# EAGLE design schematic (EAGLE 9.6.2)
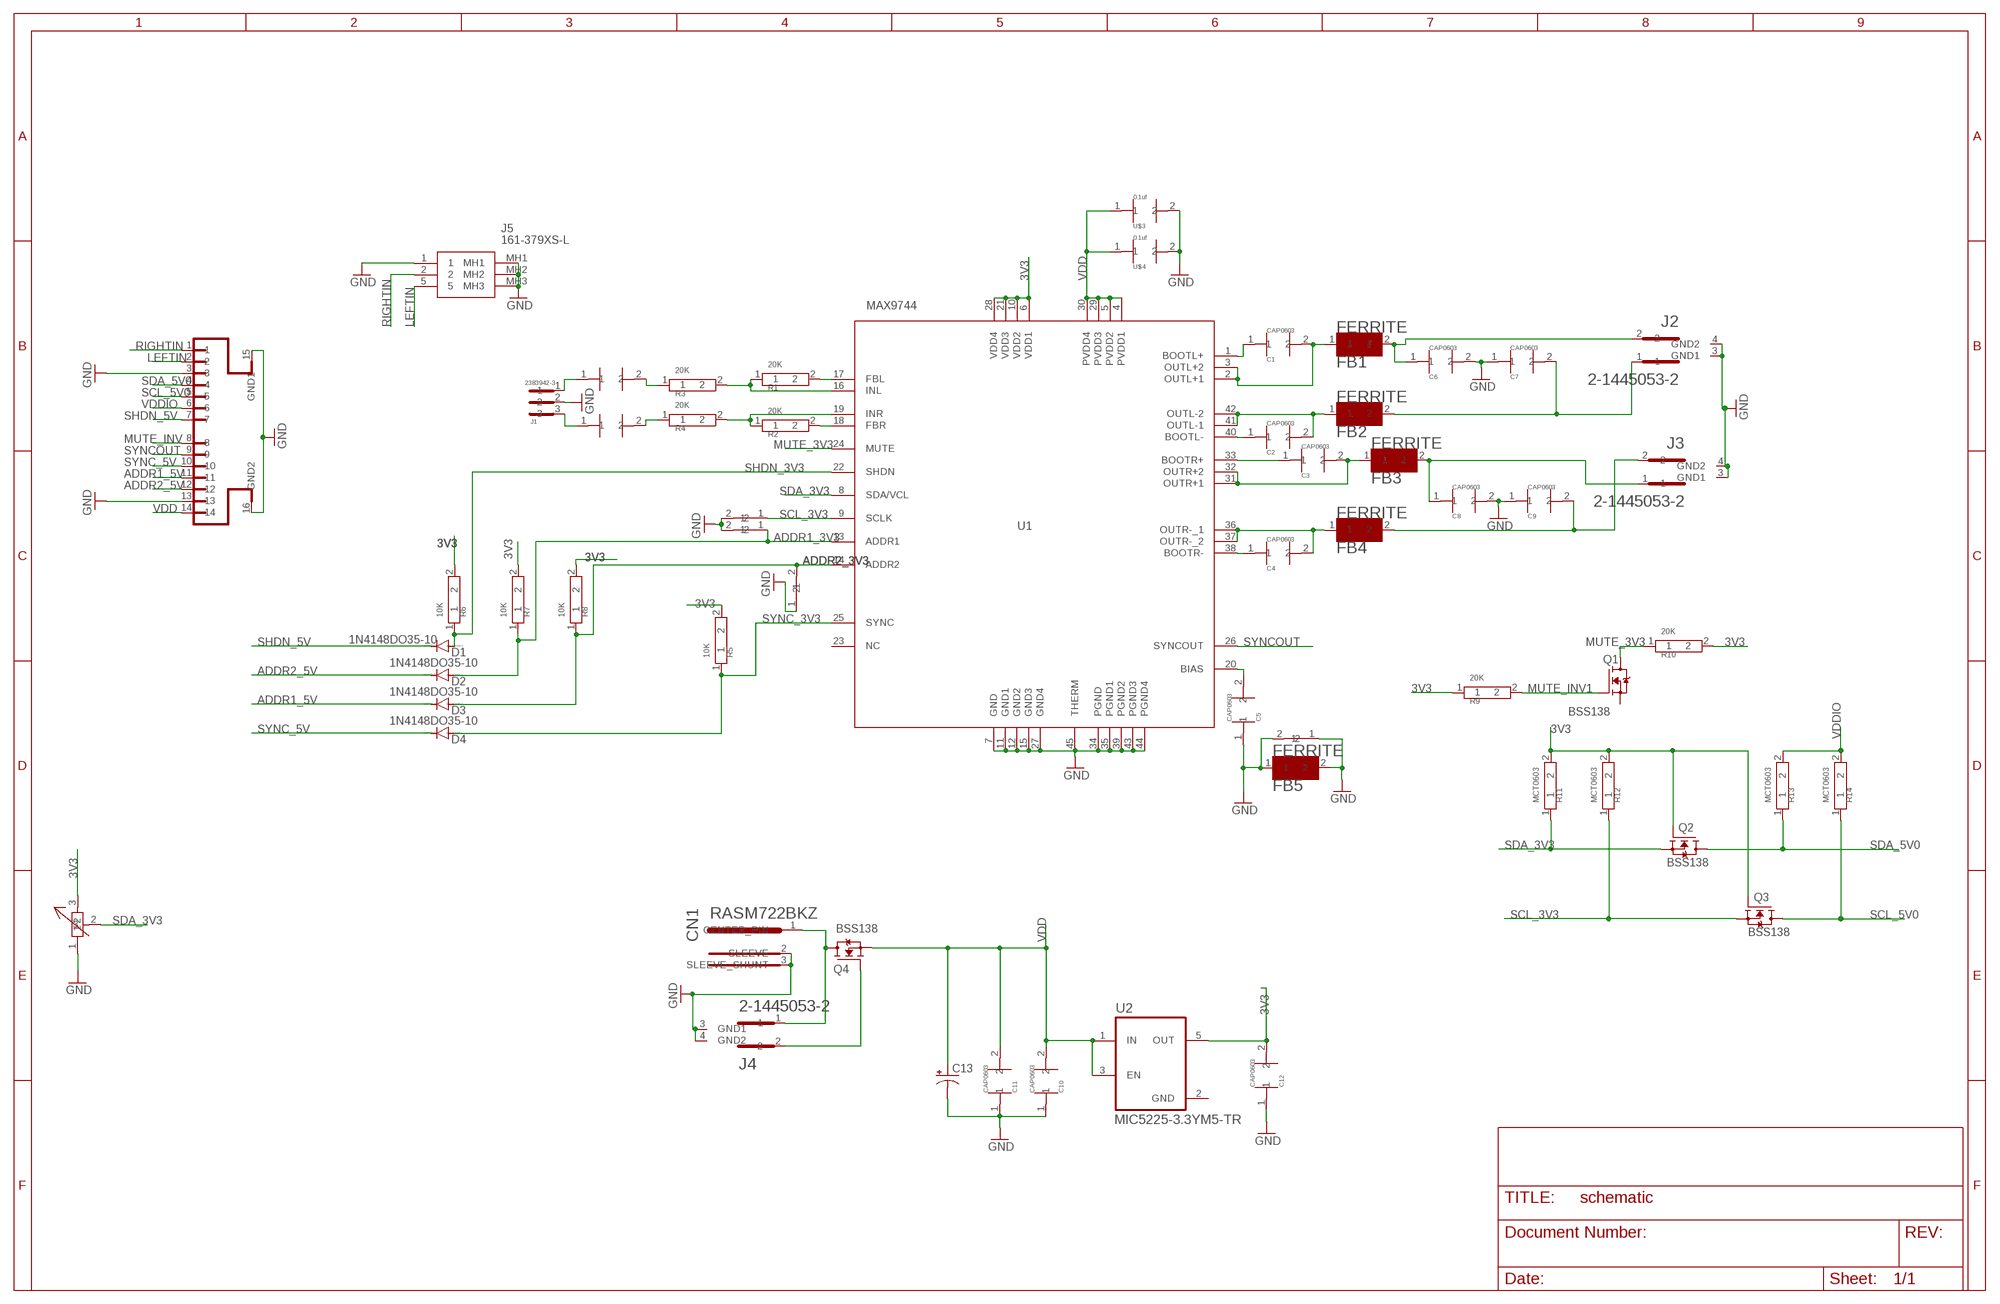
[diagram p0: schematic, sheet 1]

## Parts
C1  CAP0603  [CAP0603]
C2  CAP0603  [CAP0603]
C3  CAP0603  [CAP0603]
C4  CAP0603  [CAP0603]
C5  CAP0603  [CAP0603]
C6  CAP0603  [CAP0603]
C7  CAP0603  [CAP0603]
C8  CAP0603  [CAP0603]
C9  CAP0603  [CAP0603]
C10  CAP0603  [CAP0603]
C11  CAP0603  [CAP0603]
C12  CAP0603  [CAP0603]
C13  CPOL-US085CS-1R  [085CS_1R]
CN1  RASM722BKZ  [RASM722BKZ]
D1  1N4148DO35-10  [DO35-10]
D2  1N4148DO35-10  [DO35-10]
D3  1N4148DO35-10  [DO35-10]
D4  1N4148DO35-10  [DO35-10]
FB1  FERRITE  [FERRITE]
FB2  FERRITE  [FERRITE]
FB3  FERRITE  [FERRITE]
FB4  FERRITE  [FERRITE]
FB5  FERRITE  [FERRITE]
J1  2383942-3  [2383942-3]
J2  2-1445053-2  [2-1445053-2]
J3  2-1445053-2  [2-1445053-2]
J4  2-1445053-2  [2-1445053-2]
J5  161-379XS-L  [161379XSL]
J6  4-794627-4  [4-794627-4]
Q1  BSS138  [SOT95P240X111-3N]
Q2  BSS138  [SOT95P240X111-3N]
Q3  BSS138  [SOT95P240X111-3N]
Q4  BSS138  [SOT95P240X111-3N]
R1  20K  MCT0603  [MCT0603]
R2  20K  MCT0603  [MCT0603]
R3  20K  MCT0603  [MCT0603]
R4  20K  MCT0603  [MCT0603]
R5  10K  MCT0603  [MCT0603]
R6  10K  MCT0603  [MCT0603]
R7  10K  MCT0603  [MCT0603]
R8  10K  MCT0603  [MCT0603]
R9  20K  MCT0603  [MCT0603]
R10  20K  MCT0603  [MCT0603]
R11  MCT0603  [MCT0603]
R12  MCT0603  [MCT0603]
R13  MCT0603  [MCT0603]
R14  MCT0603  [MCT0603]
SJ1  QPC02SXGN-RC  [QPC02SXGN-RC]
SJ2  QPC02SXGN-RC  [QPC02SXGN-RC]
SJ3  QPC02SXGN-RC  [QPC02SXGN-RC]
SJ4  QPC02SXGN-RC  [QPC02SXGN-RC]
U1  MAX9744  [MAX9744]
U2  MIC5225-3.3YM5-TR  [SOT95P280X145-5N]
U$1  0.47uf  CAP0603  [CAP0603]
U$2  CAP0603  [CAP0603]
U$3  0.1uf  CAP0603  [CAP0603]
U$4  0.1uf  CAP0603  [CAP0603]
VR1  T93YA223KT20  [T93YA223KT20]

## Nets
3V3: C12.2 Q2.1(G) Q3.1(G) R6.2 R9.1 R10.2 R11.2 R12.2 U1.6(VDD1) U1.10(VDD2) U1.21(VDD3) U1.28(VDD4) U2.5(OUT) VR1.3
ADDR1_3V3: D2.A R7.1 SJ1.1 U1.13(ADDR1)
ADDR1_5V: D3.C J6.11
ADDR2_3V3: D3.A R8.1 SJ2.2 U1.14(ADDR2)
ADDR2_5V: D2.C J6.12
GND: C5.1 C6.2 C7.1 C8.2 C9.1 C10.1 C11.1 C12.1 C13.- CN1.2(SLEEVE) CN1.3(SLEEVE_SHUNT) FB5.1 FB5.2 J1.2 J2.3(GND1) J2.4(GND2) J3.3(GND1) J3.4(GND2) J4.3(GND1) J4.4(GND2) J5.1 J5.MH1 J5.MH2 J5.MH3 J6.3 J6.13 J6.15(GND1) J6.16(GND2) SJ1.2 SJ2.1 SJ3.2 SJ4.1 SJ4.2 U1.7(GND) U1.11(GND1) U1.12(GND2) U1.15(GND3) U1.27(GND4) U1.34(PGND) U1.35(PGND1) U1.39(PGND2) U1.43(PGND3) U1.44(PGND4) U1.45(THERM) U$3.2 U$4.2 VR1.1
LEFTIN: J5.5 J6.2
MUTE_3V3: Q1.3(D) R10.1 U1.24(MUTE)
MUTE_INV: J6.8
MUTE_INV1: Q1.1(G) R9.2
N$1: R1.2 U1.17(FBL)
N$2: R2.2 U1.18(FBR)
N$3: R1.1 R3.2 U1.16(INL)
N$4: R2.1 R4.2 U1.19(INR)
N$5: R4.1 U$2.2
N$6: R3.1 U$1.2
N$7: J1.1 U$1.1
N$8: J1.3 U$2.1
N$9: CN1.1(CENTER_PIN) J4.1 Q4.3(D)
N$10: R8.2
N$11: J4.2 Q4.1(G)
N$12: R7.2
N$14: R5.2
N$16: C1.2 FB1.1 U1.2(OUTL+1) U1.3(OUTL+2)
N$17: C1.1 U1.1(BOOTL+)
N$18: C2.1 U1.40(BOOTL-)
N$19: C2.2 FB2.1 U1.41(OUTL-1) U1.42(OUTL-2)
N$20: C3.1 U1.33(BOOTR+)
N$21: C3.2 FB3.1 U1.31(OUTR+1) U1.32(OUTR+2)
N$22: C4.1 U1.38(BOOTR-)
N$23: C4.2 FB4.1 U1.36(OUTR-_1) U1.37(OUTR-_2)
N$24: C6.1 FB1.2 J2.2
N$25: C5.2 U1.20(BIAS)
N$27: C7.2 FB2.2 J2.1
N$28: C8.1 FB3.2 J3.1
N$30: C9.2 FB4.2 J3.2
RIGHTIN: J5.2 J6.1
SCL_3V3: Q3.2(S) R12.1 SJ3.1 U1.9(SCLK)
SCL_5V0: J6.5 Q3.3(D) R14.1
SDA_3V3: Q2.2(S) R11.1 U1.8(SDA/VCL) VR1.2
SDA_5V0: J6.4 Q2.3(D) R13.1
SHDN_3V3: D1.A R6.1 U1.22(SHDN)
SHDN_5V: D1.C J6.7
SYNC_3V3: D4.A R5.1 U1.25(SYNC)
SYNC_5V: D4.C J6.10
SYNCOUT: J6.9 U1.26(SYNCOUT)
VDD: C10.2 C11.2 C13.+ J6.14 Q4.2(S) U1.4(PVDD1) U1.5(PVDD2) U1.29(PVDD3) U1.30(PVDD4) U2.1(IN) U2.3(EN) U$3.1 U$4.1
VDDIO: J6.6 R13.2 R14.2
Unconnected: Q1.2(S) U1.23(NC)

## Power pins joined to a net without a drawn wire
GND: U2.2(GND)

## Library data of the parts
C1-C12 U$1-U$4 = wattn:CAP0603
C13 = rcl:CPOL-US: POLARIZED CAPACITOR, American symbol; SPICEPREFIX: C
CN1 = wattn:RASM722BKZ
D1-D4 = diode:1N4148: DIODE high speed (Philips)
FB1-FB5 = wattn:FERRITE
J1 = wattn:2383942-3
J2-J4 = wattn:2-1445053-2
J5 = wattn:161-379XS-L: Phone Connectors Phone Jacks 3.5MM STEREO SHIELD Source: Datasheet <https://www.mouser.com/datasheet/2/209/KC_301505-2583635.pdf>; DESCRIPTION: Phone Connectors Phone Jacks 3.5MM STEREO SHIELD; HEIGHT: 12.7mm; MANUFACTURER_NAME: Kobiconn; MANUFACTURER_PART_NUMBER: 161-379XS-L; MOUSER_PART_NUMBER: 161-379XS-L; MOUSER_PRICE-STOCK: https://www.mouser.co.uk/ProductDetail/Kobiconn/161-379XS-L?qs=KUoIvG%2F9IlZPkPs4JIlVxQ%3D%3D
J6 = wattn:4-794627-4
Q1-Q4 = wattn:BSS138: N-Channel 50V 220mA (Ta) 360mW (Ta) Surface Mount SOT-23-3 Check availability <https://pricing.snapeda.com/parts/BSS138/ON%20Semiconductor/view-part?ref=eda>; AVAILABILITY: In Stock; DESCRIPTION: N-Channel 50 V 200mA (Ta) 225mW (Ta) Surface Mount SOT-23-3 (TO-236); MF: ON Semiconductor; MP: BSS138; PACKAGE: SOT-23 ON; PRICE: None; PURCHASE-URL: https://pricing.snapeda.com/search/part/BSS138/?ref=eda
R1-R14 = wattn:MCT0603
SJ1-SJ4 = wattn:QPC02SXGN-RC
U1 = wattn:MAX9744
U2 = wattn:MIC5225-3.3YM5-TR: MIC5225 Series 150 mA 3.3 V Fixed Output Surface Mount LDO Regulator SOT-23-5 Check availability <https://pricing.snapeda.com/parts/MIC5225-3.3YM5-TR/Microchip/view-part?ref=eda>; AVAILABILITY: In Stock; DESCRIPTION: Linear Voltage Regulator IC Positive Fixed 1 Output 150mA SOT-23-5; MF: Microchip; MP: MIC5225-3.3YM5-TR; PACKAGE: SOT-23 Microchip; PRICE: None; PURCHASE-URL: https://pricing.snapeda.com/search/part/MIC5225-3.3YM5-TR/?ref=eda
VR1 = wattn:T93YA223KT20

## Board
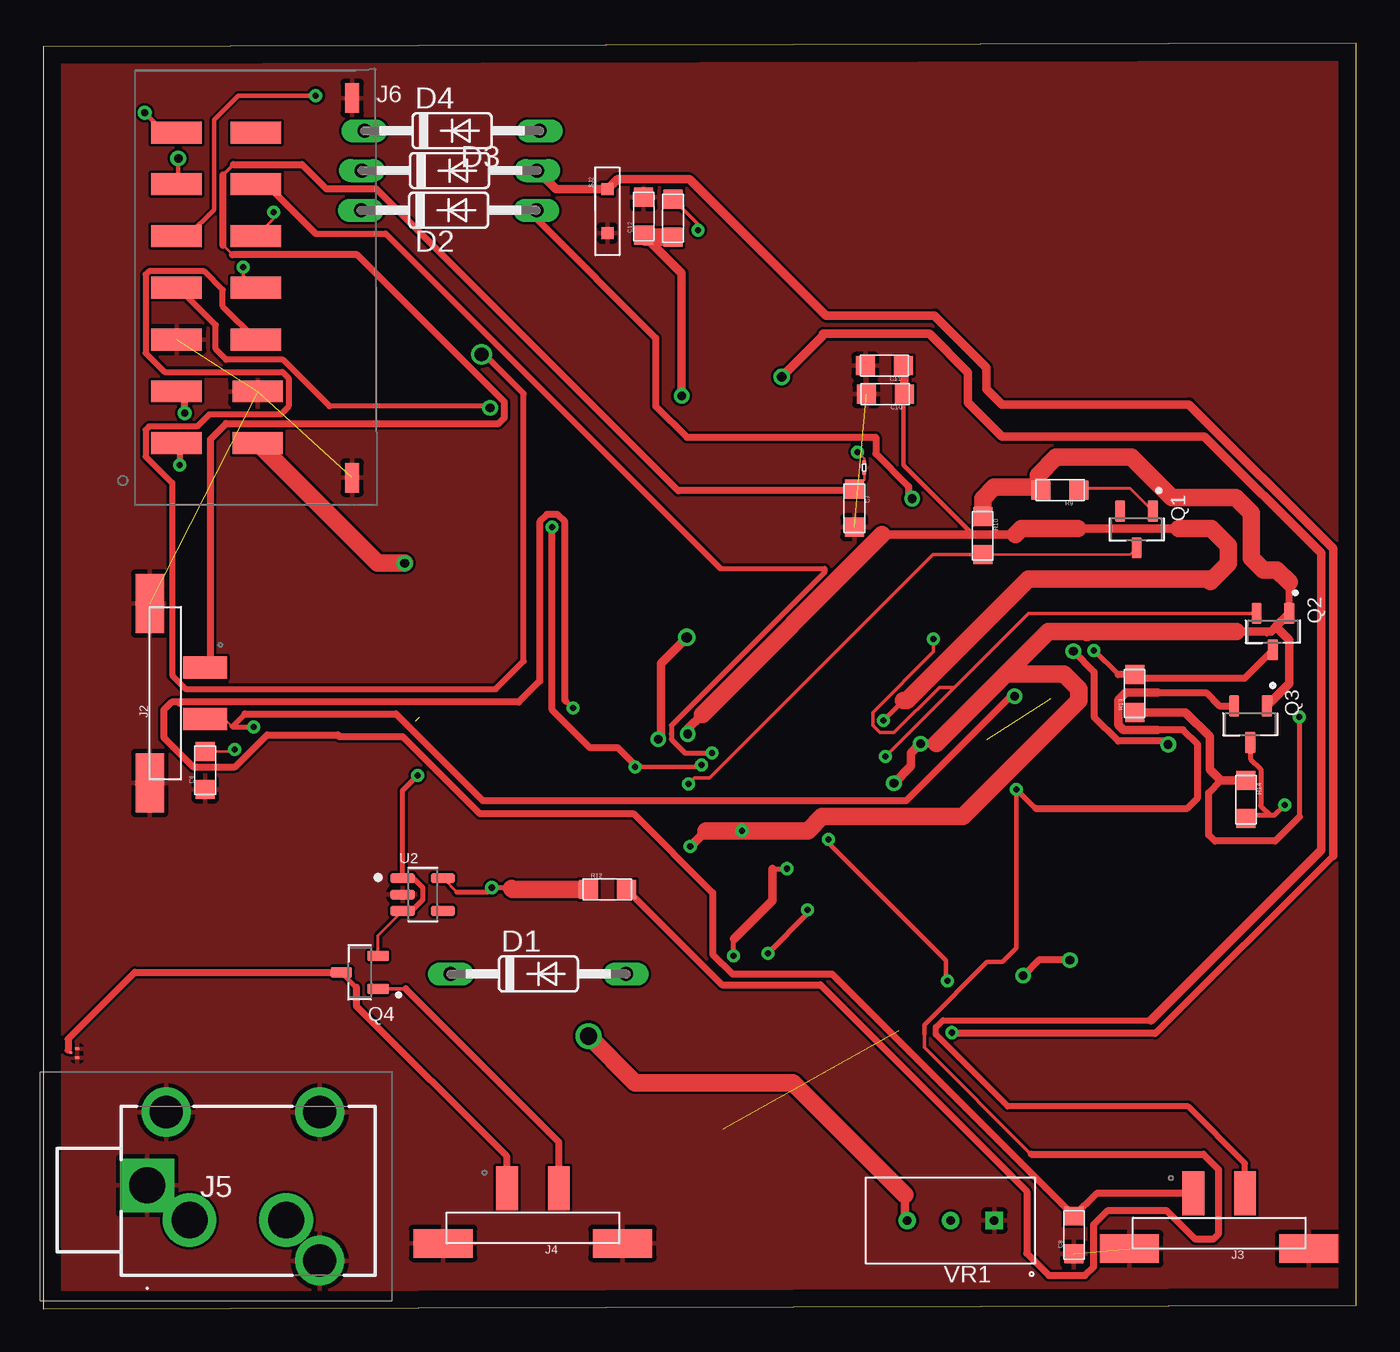
[diagram p1: board, top side]
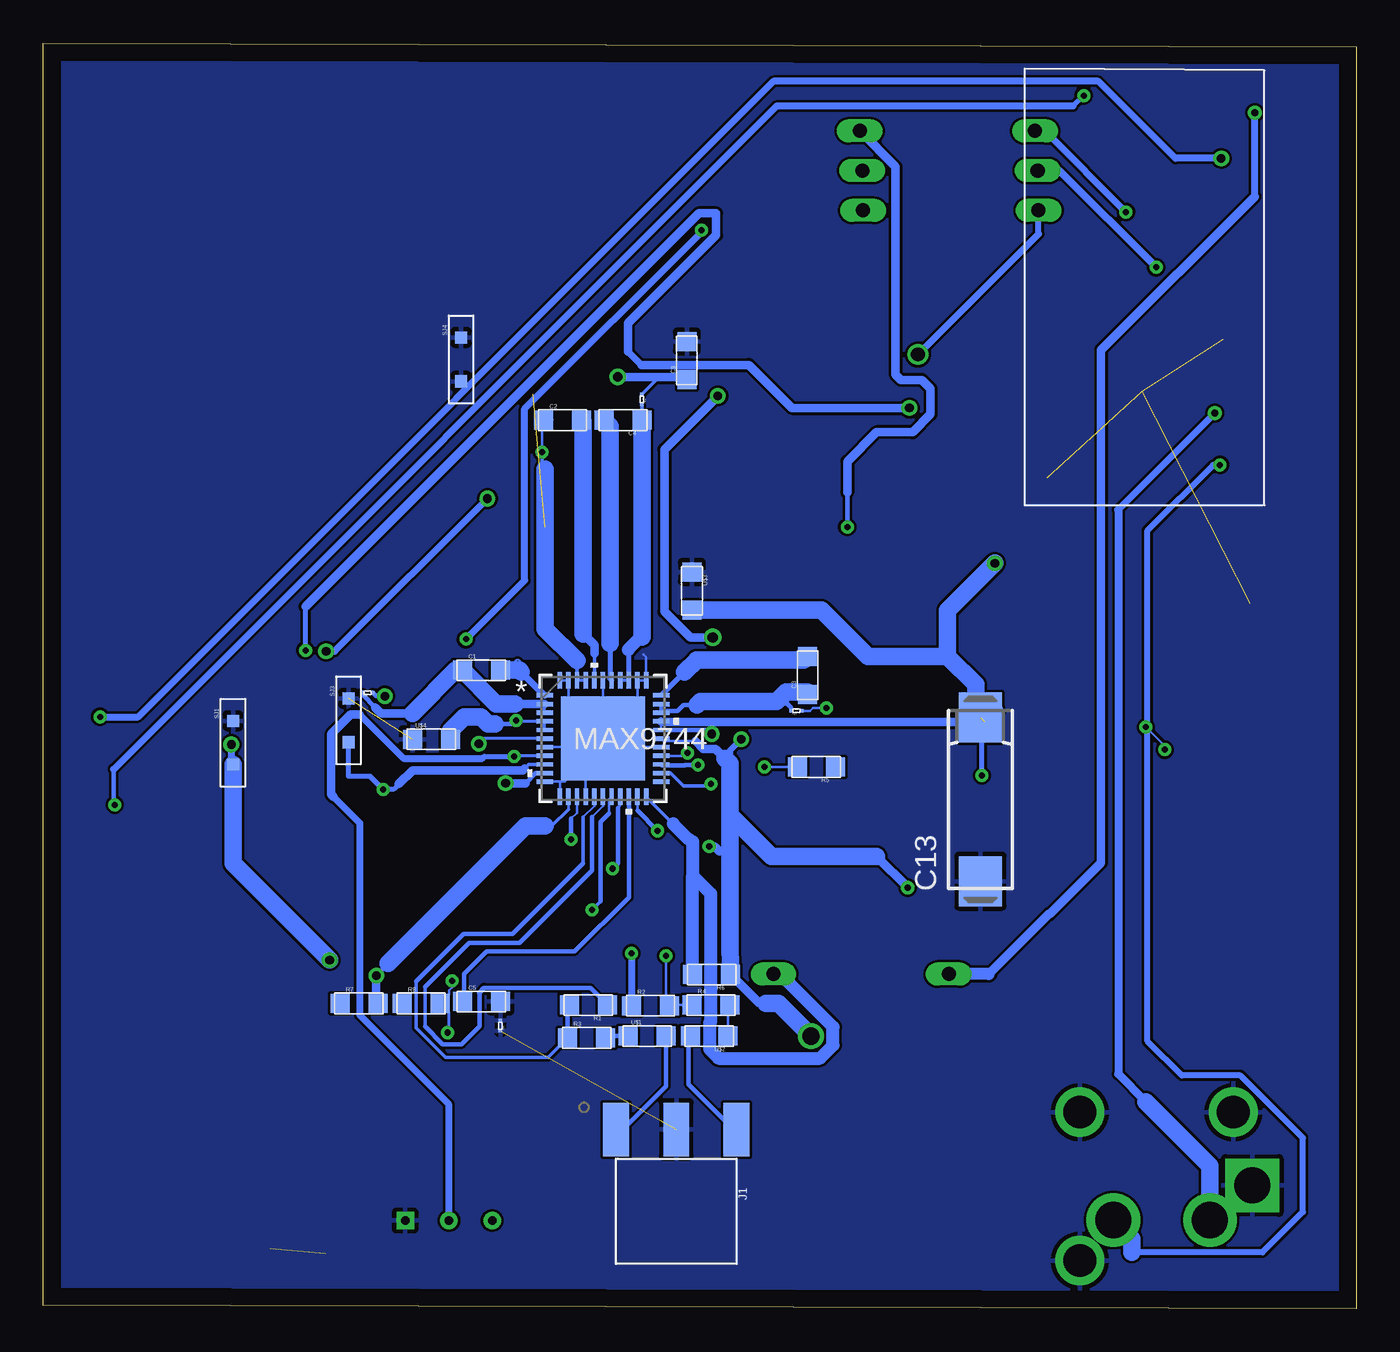
[diagram p2: board, bottom side, seen from below]

Size 76.1 x 73.34 mm. Coordinates in mm from the lower left corner, seen from the top.
Outline: 0,0 76.1,0.2 76.1,73.34 0,73.14 0,0
Copper layers (1*16): Top 0.035mm / dielectric 1.5mm / Bottom 0.035mm
Design rules "default": minimum track width 6mil, minimum drill 0.35mm, track to track 6mil, track to pad 6mil, pad to pad 6mil, via to via 6mil, smd to smd 6mil, copper to edge 40mil, drill to drill 6mil, minimum pad ring 10mil, minimum via ring 8mil, stop-mask expansion 4mil, vias tented up to drill 0mil, thermal gap 10mil

### Footprints (pad centres in the part's own frame; a part is rotated, then mirrored left to right if it is on the bottom)
CAP0603 = smd 1.1 x 1.1: 1 -1.1,0; 2 1.1,0
085CS_1R = smd 2.9 x 2.5: + 4.75,0; - -4.75,0
RASM722BKZ = smd 0.15 x 0.16: 1 0,0.36 | smd 0.15 x 0.25: 2 -0.283,0 | smd 0.13 x 0.25: 3 0.24,0
DO35-10 = drill 0.813 long: A 5.08,0; C -5.08,0
FERRITE = smd 0.2 x 0.2: 1 -0.3,0; 2 0.3,0
2383942-3 = smd 1.5 x 3.1: 1 -3.5,0; 2 0,0; 3 3.5,0
2-1445053-2 = smd 1.27 x 2.54: 1 -1.5,0; 2 1.5,0 | smd 3.43 x 1.65: 3 -5.2,-3.2; 4 5.2,-3.2
161379XSL = drill 2.09 pad 2.3 square: 1 0,0 | drill 2.09 pad 2.9: 2 -8.05,2; 5 -2.45,2 | drill 1.9 pad 2.65: MH1 -1.1,-4.25; MH2 -10,-4.25; MH3 -10,4.35
4-794627-4 = smd 1.27 x 2.92: 1 -9,1.7; 2 -6,1.7; 3 -3,1.7; 4 0,1.7; 5 3,1.7; 6 6,1.7; 7 9,1.7; 8 9,-2.9; 9 6,-2.9; 10 3,-2.9; 11 0,-2.9; 12 -3,-2.9; 13 -6,-3; 14 -9,-3 | smd 1.715 x 0.825: 15 -11,-8.48; 16 11,-8.48
SOT95P240X111-3N = smd 1.23 x 0.6: 1 -1.06,0.95; 2 -1.06,-0.95; 3 1.06,0
MCT0603 = smd 1.1 x 1.1: 1 -1.1,0; 2 1.1,0
QPC02SXGN-RC = smd 0.7 x 0.7: 1 -1.27,0; 2 1.27,0
MAX9744 = smd 0.965 x 0.254: 1 -3.428,2.49; 2 -3.428,1.99; 3 -3.428,1.49; 4 -3.428,0.99; 5 -3.428,0.49; 6 -3.428,-0.01; 7 -3.428,-0.51; 8 -3.428,-1.01; 9 -3.428,-1.51; 10 -3.428,-2.01; 11 -3.428,-2.51; 23 3.328,-2.51; 24 3.328,-2.01; 25 3.328,-1.51; 26 3.328,-1.01; 27 3.328,-0.51; 28 3.328,-0.01; 29 3.328,0.49; 30 3.328,0.99; 31 3.328,1.49; 32 3.328,1.99; 33 3.328,2.49 | smd 0.254 x 0.965: 12 -2.55,-3.388; 13 -2.05,-3.388; 14 -1.55,-3.388; 15 -1.05,-3.388; 16 -0.55,-3.388; 17 -0.05,-3.388; 18 0.45,-3.388; 19 0.95,-3.388; 20 1.45,-3.388; 21 1.95,-3.388; 22 2.45,-3.388; 34 2.45,3.368; 35 1.95,3.368; 36 1.45,3.368; 37 0.95,3.368; 38 0.45,3.368; 39 -0.05,3.368; 40 -0.55,3.368; 41 -1.05,3.368; 42 -1.55,3.368; 43 -2.05,3.368; 44 -2.55,3.368 | smd 4.851 x 4.851: 45 -0.05,-0.01
SOT95P280X145-5N = smd 1.39 x 0.58: 1 -1.165,0.95; 2 -1.165,0; 3 -1.165,-0.95; 4 1.165,-0.95; 5 1.165,0.95
T93YA223KT20 = drill 0.5 square: 1 -2.54,0 | drill 0.5: 2 0,0; 3 2.5,0

### Placement (x,y rotation side)
C1  50.7,37 180 bottom
C2  46,51.5 180 bottom
C3  31.8,36.7 270 bottom
C4  42.5,51.5 0 bottom
C5  50.7,17.8 180 bottom
C6  9.39,31.2 270 top
C7  47.01,46.39 90 top
C8  59.74,4.27 270 top
C9  38.8,54.95 270 bottom
C10  48.8,53 0 top
C11  48.75,54.65 0 top
C12  34.8,63.3 270 top
C13  21.79,29.52 90 bottom
CN1  1.97,14.83 90 top
D1  28.7,19.4 0 top
D2  23.5,63.66 0 top
D3  23.55,65.96 0 top
D4  23.7,68.26 0 top
FB1  57.3,35.7 0 bottom
FB2  47.58,48.75 270 top
FB3  32.45,34.65 0 bottom
FB4  41.4,52.7 90 bottom
FB5  49.6,16.4 90 bottom
J1  39.41,10.39 0 bottom
J2  9.38,35.67 270 top
J3  68.15,6.68 0 top
J4  28.38,6.98 0 top
J5  6.03,7.14 180 top
J6  9.43,59.16 90 top
Q1  63.36,45.16 270 top
Q2  71.26,39.24 270 top
Q3  69.96,33.87 270 top
Q4  18.35,19.49 180 top
R1  44.5,17.6 0 bottom
R2  40.9,17.56 180 bottom
R3  44.6,15.7 180 bottom
R4  37.4,17.6 180 bottom
R5  31.3,31.4 0 bottom
R6  37.36,19.36 0 bottom
R7  57.8,17.7 180 bottom
R8  54.2,17.7 180 bottom
R9  58.93,47.44 0 top
R10  54.45,44.8 90 top
R11  36.5,63.2 270 top
R12  32.7,24.3 180 top
R13  63.25,35.65 270 top
R14  69.7,29.5 90 top
SJ1  65.1,32.8 90 bottom
SJ2  32.7,63.6 90 top
SJ3  58.4,34.1 90 bottom
SJ4  51.88,55.01 90 bottom
U1  43.61,33.05 0 bottom
U2  22,24 0 top
U$1  41.1,15.8 180 bottom
U$2  37.5,15.8 0 bottom
U$3  38.5,41.6 90 bottom
U$4  53.6,33 180 bottom
VR1  52.58,5.11 180 top

### Tracks (layer width: path | path; a pad name or v marks a point on that pad's centre or on a via)
3V3  (via drill 0.35, 0.5, 0.6, 1)
  Top 0.152: v40.5,27.7 40.4,27.7 | 71.43,39.52 70.91,39
  Top 0.18: U2.5 23.96,24.15
  Top 0.3: 27.14,24.36 27.1,24.4 v26,24.4 25.75,24.15 23.96,24.15
  Top 0.4: Q2.1 72.2,42.1
  Top 0.5: 38.4,27.7 v37.5,26.8 | v49.3,30.45 50.3,31.45 50.3,32.2 v50.85,32.75 51.76,32.75 | v37.3,38.9 35.8,37.4 35.8,33.15 v35.65,33 | C12.2 37,60 v37,52.9 | 67.69,39.23 67.65,39.19 | 71.43,39.52 71.16,39.25 69.15,39.25 | 71.43,39.52 Q2.1 | Q3.1 72.2,36.22 72.2,38.75 71.43,39.52 | VR1.3 49.95,5.24 49.95,6.6
  Top 1: 38.4,27.7 40.4,27.7 44.32,27.7 45.14,28.52 53.3,28.52 60.02,35.24 60.02,35.91 59.16,36.77 55.78,36.77 | 27.14,24.36 27.2,24.3 R12.2 | 51.76,32.75 55.78,36.77 | R11.2 34.9,62.1 C12.2 | 60.49,39.19 60.53,39.23 | 60.53,39.23 67.69,39.23 69.13,39.23 69.15,39.25 | 60.53,39.23 58.24,39.23 55.78,36.77 | R10.2 54.45,46.95 55.1,47.6 57.67,47.6 | 57.67,47.6 R9.1 | 57.67,47.6 57.67,48.32 58.7,49.35 63.05,49.35 65.4,47 69.1,47 70,46.1 70,43.5 70.7,42.8 71.5,42.8 72.2,42.1 | v31.6,15.8 34.3,13.1 43.45,13.1 49.95,6.6
  Bottom 0.152: U1.28 40.14,32.9 38.3,32.9 | U1.21 41.66,28.86
  Bottom 0.18: U1.6 50.56,33.04 v50.85,32.75
  Bottom 0.25: 41.66,28.86 v40.5,27.7 | U1.10 47.56,31.04 48.15,30.45
  Bottom 0.35: v35.65,33 36.3,32.35 36.3,31.9
  Bottom 0.5: v37.5,26.8 37.2,26.8 36.9,26.5 36.3,26.5 | 48.15,30.45 v49.3,30.45 | 36.3,31.9 36.6,31.9 37.15,32.45 37.85,32.45 38.3,32.9 | 35.8,33 v35.65,33 | v37,52.9 40.1,49.8 40.1,40.4 38.6,38.9 v37.3,38.9 | 34.2,17.7 34.6,17.7 R6.2 | v26,24.4 27.8,26.2
  Bottom 1: 36.6,31.9 36.3,31.6 36.3,28.6 | R6.2 36.3,21.52 36.3,26.5 36.3,28.6 | v31.6,15.8 33.5,17.7 34.2,17.7 | 36.3,28.6 33.9,26.2 27.8,26.2
ADDR1_3V3  (via drill 0.5)
  Top 0.152: 28.58,63.18 D2.A
  Top 0.2: 50.15,46.95 v50.35,46.95
  Top 0.4: v59.5,20.2 57.7,20.2 v56.8,19.3 | 50.15,46.95 50.15,47.65 48.26,49.54 48.26,50.5 37.3,50.5 35.5,52.3 35.5,56.26 28.58,63.18 | v59.7,38.1 60.9,36.9 60.9,34.3 62.3,32.9 65,32.9 v65.2,32.7
  Bottom 0.152: U1.13 45.66,28.94 | 56.7,17.9 R7.1 | 65.2,31.63 SJ1.1
  Bottom 0.18: 56.8,17.8 R7.1
  Bottom 0.2: 45.66,28.94 46.63,27.97 47,27.97
  Bottom 0.25: v56.8,19.3 56.1,20
  Bottom 0.4: v59.7,38.1 59.2,38.1 v50.35,46.95 | v65.2,32.7 65.2,31.63
  Bottom 0.5: v56.8,19.3 56.8,17.8
  Bottom 1: SJ1.1 65.1,25.8 v59.5,20.2 | 56.1,20 48.13,27.97 47,27.97
ADDR1_5V  (via drill 0.35)
  Top 0.18: J6.11 11.6,59.89
  Top 0.2: v11.6,60.35 11.6,59.89
  Bottom 0.25: D3.C 17.21,65.96
  Bottom 0.43: 17.21,65.96 v11.6,60.35
ADDR2_3V3  (via drill 0.35)
  Top 0.152: v52.41,19 52.31,19.1
  Top 0.25: v45.5,27.2 45.5,27 52.31,20.19 52.31,19.1
  Top 0.3: 52.7,15.95 v52.65,16
  Top 0.4: 74.75,26.25 64.45,15.95 52.7,15.95
  Top 0.5: 28.69,65.9 D3.A 29.72,64.87 SJ2.2 33.28,65.45 37.45,65.45 45.35,57.55 51.65,57.55 54.65,54.55 54.65,53.3 55.55,52.4 66.4,52.4 74.75,44.05 74.75,26.25
  Bottom 0.152: U1.14 45.16,28.74 45.5,28.4 | R8.1 52.58,18.22 52.58,18.45 52.41,18.62 v52.41,19
  Bottom 0.18: R8.1 52.59,17.19 52.59,16.06 v52.65,16
  Bottom 0.25: 45.5,28.4 v45.5,27.2
ADDR2_5V  (via drill 0.8 pad 1)
  Top 0.35: v25.4,55.3 25.57,55.3 27.85,53.02 27.85,37.53 26.23,35.91 8.27,35.91 7.48,36.7 7.48,47.85 5.94,49.39 5.94,50.93 6.13,51.12 8.92,51.12 9.62,51.83 13.75,51.83 14.22,52.29 14.22,53.93 13.87,54.28 7.05,54.28 5.94,55.39 5.94,59.93 6.13,60.12 9.33,60.12 10.42,59.03 10.42,58.07 J6.12
  Bottom 0.35: 18.42,62.28 D2.C
  Bottom 0.4: v25.4,55.3 18.42,62.28
GND  (7 unrouted)
  Bottom 0.152: U1.45 41.66,35.04 U1.35 U1.34 41.16,37.76 41.3,37.9 | U1.27 43.16,32.54 43.51,32.89 | 43.51,32.89 U1.45 | U1.44 U1.43 45.66,35.04 43.81,33.19 | 43.81,33.19 U1.45 | U1.39 43.66,33.34 43.81,33.19 | U1.7 43.86,32.54 | 43.86,32.54 43.51,32.89 | U1.11 46.2,30.54 | 46.2,30.54 45.86,30.54 44.85,31.55 | 44.85,31.55 43.86,32.54 | U1.12 46.16,30.5 46.2,30.54 | U1.15 44.66,31.36 44.85,31.55
  pour Bottom: 0.1,72.9 75.3,72.9 75.3,1.1 0.1,1.1
  pour Top: 0.1,72.7 75.9,72.7 75.9,1.1 0.1,1.1
LEFTIN  (via drill 0.4)
  Top 0.18: 8.2,52.69 J6.2
  Top 0.4: v8.2,51.9 8.2,52.69
  Bottom 0.4: v8.2,51.9 13.8,46.3
  Bottom 0.45: 13.8,46.3 13.8,13.6 12.2,12
  Bottom 1: 12.2,12 8.48,8.28 J5.5
MUTE_3V3  (via drill 0.35)
  Top 0.152: R10.1 62.96,43.7 Q1.3
  Top 0.2: v37.4,30.4 37.74,30.74 38.6,30.74 51.56,43.7 R10.1
  Bottom 0.152: U1.24 39.73,31.04 | 37.5,30.3 v37.4,30.4
  Bottom 0.2: 39.73,31.04 38.99,30.3 37.5,30.3
MUTE_INV1
  Top 0.18: R9.2 60.13,47.54 62.99,47.54 Q1.1
N$1
  Bottom 0.152: U1.17 43.66,29.14 44.3,28.5
  Bottom 0.2: 53.98,18.65 53.98,16.35
  Bottom 0.25: 44.3,28.5 44.3,25.4 48.49,21.2 51.42,21.2 53.98,18.65 | 53.98,16.35 52.95,15.32 51.85,15.32 50.82,16.35 50.82,18.3 | 50.54,18.58 44.38,18.58 R1.2
  Bottom 0.3: 50.82,18.3 50.54,18.58
N$2  (via drill 0.35)
  Top 0.25: v44.3,23.1 44.3,22.9
  Top 0.3: 44.3,22.9 v42,20.6
  Bottom 0.152: U1.18 43.3,29.52 43.3,28.7
  Bottom 0.2: 43.8,23.6 v44.3,23.1
  Bottom 0.25: 43.3,28.7 43.8,28.2 43.8,23.6
  Bottom 0.4: v42,20.6 R2.2
N$3
  Bottom 0.152: U1.16 44.16,29.14 44.8,28.5 | 45.7,17.5 R1.1
  Bottom 0.2: 54.48,18.97 54.48,16.28 52.78,14.57 46.83,14.57 R3.2 | 44.8,28.5 44.8,25.8
  Bottom 0.25: 54.48,18.97 51.74,21.71 48.89,21.71 44.8,25.8 | R3.2 45.7,17.5
N$4  (via drill 0.35)
  Top 0.3: 42.25,25.5 v43.1,25.5 | v40,20.45 40,21.4 40.02,21.42
  Top 0.5: 40.02,21.42 42.25,23.65 42.25,25.5
  Bottom 0.152: 42.8,29.02 42.66,29.16 U1.19 | v40,20.45 40,17.76 R2.1 39.76,17.6 R4.2
  Bottom 0.25: 42.8,29.02 42.8,25.8 v43.1,25.5
N$5
  Bottom 0.152: U$2.2 36.4,17.5 R4.1
N$6
  Bottom 0.152: 43.4,15.8 R3.1
  Bottom 0.25: U$1.2 43.4,15.8
N$7
  Bottom 0.152: J1.1 42.71,10.19
  Bottom 0.25: U$1.1 40,12.9 42.71,10.19
N$8
  Bottom 0.152: 38.7,15.7 U$2.1
  Bottom 0.25: J1.3 36.09,10.39 38.7,13 38.7,15.7
N$9
  Top 0.152: 1.45,14.99 CN1.1
  Top 0.18: J4.1 26.76,6.98
  Top 0.3: 15.79,19.49 Q4.3 18.15,18.63
  Top 0.4: Q4.3 5.31,19.49 1.45,15.63 1.45,14.99 | J4.1 26.88,8.82 18.15,17.55 18.15,18.63
N$11
  Top 0.2: Q4.1 21.01,18.54
  Top 0.4: J4.2 29.88,9.67 21.01,18.54
N$16
  Bottom 0.18: U1.3 U1.2
  Bottom 0.25: 56.85,34.84 57.6,35.59 FB1.1
  Bottom 0.5: U1.2 48.74,35.04 48.8,35.1 | 54.7,34.5 56.51,34.5 56.85,34.84
  Bottom 1: 48.74,35.04 49.84,35.04 C1.2 52.2,37 54.7,34.5
N$17
  Bottom 0.4: U1.1 48.4,36.9
  Bottom 1: 48.4,36.9 48.5,37 C1.1
N$18
  Bottom 0.18: 44.8,51.4 C2.1
  Bottom 0.2: U1.40 44.16,37.96
  Bottom 0.5: 44.16,37.96 44.16,38.46 44.8,39.1
  Bottom 1: C2.1 44.8,51.4 44.8,50.68 44.8,39.1
N$19  (via drill 0.35)
  Top 0.152: v47.2,49.65 47.58,49.27 FB2.1
  Bottom 0.152: C2.2 47.2,51.4 v47.2,49.65
  Bottom 0.18: U1.41 U1.42 | 46.6,51.5 C2.2
  Bottom 0.2: U1.42 45.16,37.56 45.16,37.86 45.2,37.9 | v47.2,49.65 47.2,48.85 47,48.65
  Bottom 1: 47,48.65 47,39.4 45.16,37.56
N$20
  Bottom 0.3: U1.33 38.92,36.9
  Bottom 1: C3.1 32,37.6 38.25,37.6 38.25,37.57 38.92,36.9
N$21
  Bottom 0.152: 32.24,36.04 C3.2 | FB3.1 32.75,34.85
  Bottom 0.2: U1.32 U1.31
  Bottom 0.25: 38.2,35 39,35 39.35,34.65 40.17,34.65 U1.31 | 32.75,34.85 33.1,35.2
  Bottom 0.5: 33.1,35.2 33.6,35.2
  Bottom 1: 38.2,35 38,35.2 33.6,35.2 33.05,35.75 31.8,35.75 C3.2
N$22
  Bottom 0.3: U1.38 43.26,36.52 43.26,38.56 43.3,38.6
  Bottom 1: 43.26,38.56 43.26,51.16 C4.1
N$23
  Bottom 0.18: U1.36 U1.37
  Bottom 0.2: C4.2 FB4.1
  Bottom 0.3: U1.36 42.16,38.16 42.2,38.2
  Bottom 0.75: 42.2,38.2 41.48,38.92 41.4,38.92
  Bottom 1: 41.4,38.92 C4.2
N$24  (via drill 0.35, 0.5)
  Top 0.152: J2.2 10.53,34.17 10.95,33.75 | v11.1,32.4 11,32.3 C6.1
  Top 0.18: 11.4,34.17 11.62,34.38 11.7,34.47
  Top 0.3: 11.62,34.38 10.98,33.75 10.95,33.75 11,33.7 v12.2,33.7
  Top 0.4: v56.3,35.5 56.08,35.5 50.01,29.43 25.49,29.43 20.45,34.47 11.7,34.47
  Bottom 0.152: v12.2,33.7 11.1,32.6 v11.1,32.4
  Bottom 0.25: FB1.2 56.8,35.5 v56.3,35.5
N$25
  Bottom 0.25: U1.20 42.16,23.84 45.3,20.7 50.4,20.7 51.7,19.4 51.7,17.9 C5.2
N$27
  Top 0.152: FB2.2 47.58,48.06 C7.2
  Top 0.18: 10.97,61.08 10.43,61.62
  Top 0.2: J2.1 9.68,37.47 | 10.43,65.71 11.02,66.3
  Top 0.4: C7.2 46.92,47.4 36.8,47.4 19.3,64.9 16.4,64.9 15,66.3 11.02,66.3 | 10.97,61.08 18.2,61.08 26.74,52.54 26.74,51.64 26.4,51.3 10.6,51.3 9.68,50.38 9.68,37.47 | 10.43,61.62 10.43,65.71
N$28  (via drill 0.35)
  Top 0.2: 17.07,33.26 17.17,33.16
  Top 0.3: v30.7,34.8 30.3,35.2 30.2,35.2
  Top 0.4: J3.1 61.05,6.68 C8.1 45.72,19.39 39.95,19.39 38.8,20.55 38.8,24.1 34.2,28.7 25.3,28.7 20.84,33.16 17.17,33.16 | 30.3,35.2 30.23,35.27 30.23,45.6 29.8,46.03 29.2,46.03 28.77,45.6 28.77,36.37 27.56,35.16 7.96,35.16 | 7.9,35.1 7.96,35.16 | 7.96,35.16 7.46,35.16 7,34.7 7,33.09 8.69,31.4 11.13,31.4 12.99,33.26 17.07,33.26
  Bottom 0.152: FB3.2 31.65,34.65 31.5,34.8 v30.7,34.8
N$30  (via drill 0.55)
  Top 0.35: J3.2 69.65,8.42 66.35,11.72 55.9,11.72 51.73,15.89 51.73,16.31 52.14,16.72 64.19,16.72
  Top 0.5: 64.19,16.72 74.07,26.6 74.07,43.78 67.3,50.55 55.55,50.55 53.6,52.5 53.6,54.25 51.35,56.5 45.2,56.5 45.2,56.4 v42.8,54
  Bottom 0.152: 40.55,53.85 C9.2
  Bottom 0.2: FB4.2 40.55,53.85
  Bottom 0.5: v42.8,54 38.95,54 C9.2
RIGHTIN  (via drill 0.35)
  Top 0.18: J6.1 7.9,49.99
  Top 0.35: 7.9,49.99 v7.9,48.9
  Bottom 0.2: 8.3,48.9 v7.9,48.9
  Bottom 0.35: 13.26,3.26 13,3.26 5.45,3.26 3.1,5.61 3.1,9.9 6.71,13.51 10.11,13.51 12.1,15.5 12.1,45.1 8.3,48.9
  Bottom 1: 13,3.26 13,4.06 J5.2
SCL_3V3  (via drill 0.35)
  Top 0.2: 51.06,15.89 51.06,15.14 57.25,8.95
  Top 0.25: 69.03,34.93 Q3.2 | 51.06,15.89 51.06,16.46 54.7,20.1 55.6,20.1 56.4,20.9 v56.4,30.1
  Top 0.3: 69.03,34.92 69.03,34.93 | v56.4,30.1 57.5,29
  Top 0.4: 57.25,8.95 67.23,8.95 68.13,8.05 68.13,4.35 67.83,4.05 66.75,4.05 65.1,5.7 61.7,5.7 60.88,4.88 60.88,2.43 60.38,1.93 58.27,1.93 57,3.2 57,6.8 45.03,18.77 39.33,18.77 R12.1 | 57.5,29 66.3,29 66.9,29.6 66.9,32.7 66.05,33.55 64.55,33.55 | 69.03,34.93 68.17,34.93 67.4,35.7 64.6,35.7
  Top 0.5: 64.55,33.55 62.58,33.55 62.3,33.83 62.3,35.27 62.73,35.7 64.6,35.7
  Bottom 0.2: U1.9 47.96,31.54 48.2,31.3
  Bottom 0.3: SJ3.1 58.4,30.84 57.14,30.84 v56.4,30.1 55.8,30.1 55.5,30.4
  Bottom 0.5: 48.2,31.3 48.3,31.2 54.7,31.2 55.5,30.4
SCL_5V0  (via drill 0.35)
  Top 0.18: 8.36,62.16 J6.5
  Top 0.25: v15.8,70.3 11.3,70.3 9.9,68.9 9.9,63.7 8.36,62.16
  Top 0.3: 71.1,28.6 69.9,28.6 R14.1 | Q3.3 69.96,31.87 70.55,31.27 70.55,29.15 71.1,28.6 | 71.1,28.6 71.35,28.6 v71.95,29.2
  Bottom 0.25: v71.95,29.2 72.02,29.27 72.02,31.26
  Bottom 0.3: v15.8,70.3 16.4,69.7
  Bottom 0.4: 72.02,31.26 33.58,69.7 16.4,69.7
SDA_3V3  (via drill 0.35)
  Top 0.2: v48.8,32 52.8,36 | 52.8,36 57.1,40.3 Q2.2 | 52.8,36 51.93,36 49.31,33.38 48.49,33.38 48.08,33.79 48.08,34.56 51.6,38.08 v51.6,38.8 | R11.1 37.95,62.85 v37.95,62.5
  Bottom 0.18: U1.8 48.76,32.04 v48.8,32 | 37.95,62.39 v37.95,62.5
  Bottom 0.25: v48.81,32.01 v48.8,32
  Bottom 0.3: 50.64,31.89 50.52,32.01 v48.81,32.01
  Bottom 0.4: v51.6,38.8 48.19,42.21 48.19,52.15 37.95,62.39 | VR1.2 52.58,11.84 57.74,17 57.74,28.13 59.26,29.64 | 57.75,34.42 55.22,31.89 50.64,31.89
  Bottom 0.5: 57.75,34.42 58.28,34.42 59.4,33.3 59.4,29.79 59.26,29.64
SDA_5V0  (via drill 0.35, 0.5)
  Top 0.18: R13.1 63.47,36.53 | 7.84,59.16 J6.4
  Top 0.3: 62.3,36.75 v60.9,38.15 | v25.9,52.2 25.8,52.3 16.6,52.3
  Top 0.35: 7.84,59.16 10,57 10,55.6 10.6,55 13.9,55 16.6,52.3
  Top 0.4: Q2.3 69.61,36.53 63.47,36.53 | R13.1 62.3,36.75
  Bottom 0.3: v60.9,38.15 60.9,40.68
  Bottom 0.4: 42.19,55.45 41.43,54.69
  Bottom 0.5: 42.19,55.45 42.19,57.11 37.1,62.2 37.1,63.48 38.1,63.48 60.9,40.68 | 41.43,54.69 35.2,54.69 32.71,52.2 v25.9,52.2
SHDN_3V3
  Bottom 0.152: 38.7,27.2 38.6,27.2 38.46,27.06
  Bottom 0.2: U1.22 39.6,28.1
  Bottom 0.75: 39.6,28.1 38.7,27.2 | 38.46,27.06 38.46,25.1 | R6.1 38.46,25.1 | D1.A 33.39,19.4 30.32,16.33 30.32,15.27 31.07,14.52 36.97,14.52 37.48,15.03 37.48,16.57 37.42,16.62 37.42,24.06 38.46,25.1
SHDN_5V  (via drill 0.4)
  Top 0.18: 7.03,68.16 J6.7
  Top 0.25: v5.89,69.3 7.03,68.16
  Bottom 0.2: 17.8,22.84 17.8,22.9
  Bottom 0.25: D1.C 23.6,19.4 23.47,19.4
  Bottom 0.4: 5.89,64.46 v5.89,69.3
  Bottom 0.5: 5.89,64.46 14.8,55.55 14.8,25.84 17.8,22.84 | 17.8,22.9 21.3,19.4
  Bottom 0.7: 21.3,19.4 23.6,19.4
SYNC_3V3  (via drill 0.35)
  Top 0.25: v38.15,31.5 38.05,31.4 v34.3,31.4 34.3,31.5
  Top 0.4: 34.3,31.5 33.3,32.5 31.7,32.5 29.5,34.7 v29.5,45.3
  Bottom 0.152: 38.89,31.49 38.9,31.5 | v34.3,31.4 R5.1
  Bottom 0.25: U1.25 40.23,31.49 38.89,31.49 | 38.9,31.5 v38.15,31.5 | v29.5,45.3 29.5,47.3
  Bottom 0.5: D4.A 26.7,66.18 26.7,54.14 26.38,53.82 25.18,53.82 24.67,53.31 24.67,51.83 25.7,50.8 27.8,50.8 29.5,49.1 29.5,47.3
SYNC_5V  (via drill 0.35)
  Top 0.18: J6.10 13.35,63.18 v13.35,63.55
  Bottom 0.25: D4.C 18.06,68.26
  Bottom 0.4: 18.06,68.26 v13.35,63.55
SYNCOUT  (via drill 0.35)
  Top 0.152: J6.9 12.93,65.16
  Top 0.3: 39.25,42.9 45.3,42.9 45.3,42.7 36.4,33.8 36.4,33.32 36.41,33.31 36.41,32.99 37.2,32.2 v38.75,32.2
  Top 0.35: 15.78,62.31 19.84,62.31 39.25,42.9
  Top 0.4: 15.78,62.31 12.93,65.16
  Bottom 0.152: U1.26 38.91,32.04 v38.75,32.2
VDD  (via drill 0.35, 0.5)  (1 unrouted)
  Top 0.18: 37.4,33.31 v37.35,33.31 | U2.3 19.41,21.62 Q4.2 | C11.2 49.9,54.6
  Top 0.25: 53.89,44.86 49.85,48.9 49.85,52.95 C10.2 | v48.7,34.1 49.85,35.25
  Top 0.3: v21.7,30.9 20.84,30.03 U2.1 21.45,24.95 22,24.4 22,23.7 21.35,23.05 U2.3
  Top 0.5: 49.9,54.6 C10.2 | 38.2,34.45 37.35,33.6 v37.35,33.31 | 48.61,44.86 53.89,44.86 56.35,44.86 56.5,44.71 | 65.8,45.2 59.95,45.2
  Top 1: v20.95,43.2 19.39,43.2 J6.14 | 48.61,44.86 38.2,34.45 | 49.85,35.25 50.05,35.25 57.08,42.28 67.52,42.28 67.65,42.15 68.67,43.17 68.67,44.23 67.7,45.2 65.8,45.2 | 56.35,44.86 56.69,45.2 59.95,45.2
  Bottom 0.152: U1.30 U1.29
  Bottom 0.18: U1.5 U1.4 48.64,34.04 v48.7,34.1 | 22.06,34 C13.+ 21.7,34.18 | U$3.1 38,40
  Bottom 0.25: U1.29 37.58,33.54 v37.35,33.31 | 49.9,33.89 48.91,33.89 v48.7,34.1
  Bottom 0.3: v21.7,30.9 21.7,34.18
  Bottom 0.5: U1.30 40.24,34 22.06,34
  Bottom 1: U$3.1 31,40.5 28.3,37.8 23.7,37.8 | 23.7,37.8 22.06,36.16 22.06,34 | 20.95,34.65 21.56,34.04 | v20.95,43.2 23.7,40.45 23.7,37.8 | U$4.1 52.5,33.5 51.7,34.3 50.73,34.3 50.32,33.89 49.9,33.89
VDDIO  (via drill 0.35, 0.5)
  Top 0.25: v7.83,66.66 7.83,65.26 J6.6
  Top 0.3: v72.8,34.3 72.8,28.5
  Top 0.4: 68.25,30.6 67.55,29.9 67.55,27.45 67.9,27.1 71.4,27.1 72.8,28.5
  Top 0.5: R13.2 66.2,34.55 67.6,33.15 67.6,31.25 68.25,30.6 R14.2
  Bottom 0.4: v7.83,66.66 10.48,66.66 14.94,71.12 33.78,71.12 70.6,34.3 v72.8,34.3